# EasyEDA Pro project ProPrj_cbadge_2025-11-28.epro

# Schematic Schematic1
Board Name: Board1; Create Date: 2025-09-24; Page Name: P1; Project Name: cbadge; Schematic Name: Schematic1; Update Date: 2025-09-24; Company: EasyEDA.com; Page Size: A4; Version: V1.0
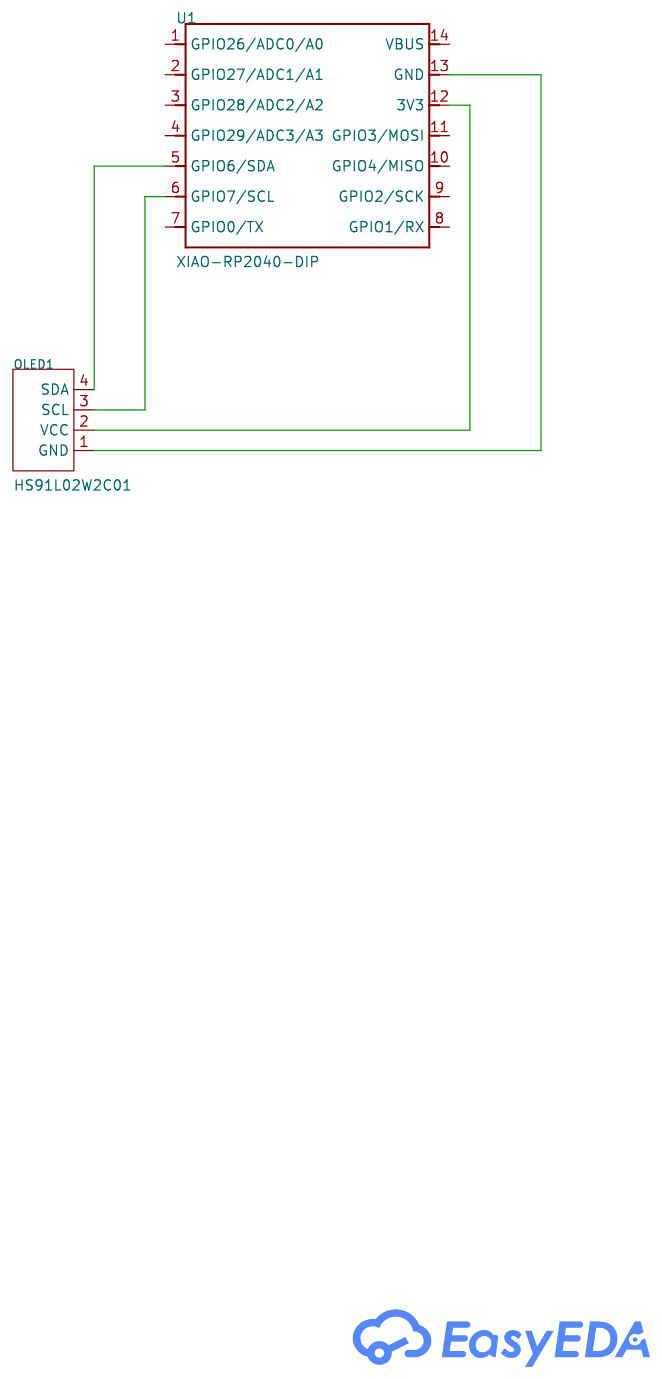
[diagram p0: schematic sheet]

## Parts
OLED1  HS91L02W2C01  [OLED-TH_L38.0-W12.0_HS91L02W2C01]
U1  XIAO-RP2040-DIP  [XIAO-RP2040-DIP]

## Library data of the parts
OLED1 = HS91L02W2C01: Main Control Chip:SSD1306 Interface Type:I2C Size:0.91 Pixel Resolution:128x32 Operating Temperature:-40℃~+70℃ Operating Temperature:-40℃~+70℃; LCSC Part Name: 0.91寸OLED显示屏白光IIC; Supplier Part: C5248081; Manufacturer: HS(汉昇); JLCPCB Part Class: Extended Part; Datasheet: https://atta.szlcsc.com/upload/public/pdf/source/20230727/C3E43C8E3DDA847F5681FEE7D95C153D.pdf; Supplier: LCSC; Main Control Chip: SSD1306; Interface Type: I2C; Size: 0.91; Pixel Resolution: 128x32; Operating Temperature: -40℃~+70℃
U1 = XIAO-RP2040-DIP

## Nets
$1N255: OLED1.4(SDA) U1.5(GPIO6/SDA)
$1N260: OLED1.3(SCL) U1.6(GPIO7/SCL)
$1N281: OLED1.1(GND) U1.13(GND)
$1N287: OLED1.2(VCC) U1.12(3V3)

Not connected (* = marked no-connect by the designer): U1 1(GPIO26/ADC0/A0) 2(GPIO27/ADC1/A1) 3(GPIO28/ADC2/A2) 4(GPIO29/ADC3/A3) 7(GPIO0/TX) 8(GPIO1/RX) 9(GPIO2/SCK) 10(GPIO4/MISO) 11(GPIO3/MOSI) 14(VBUS)

# Board PCB1
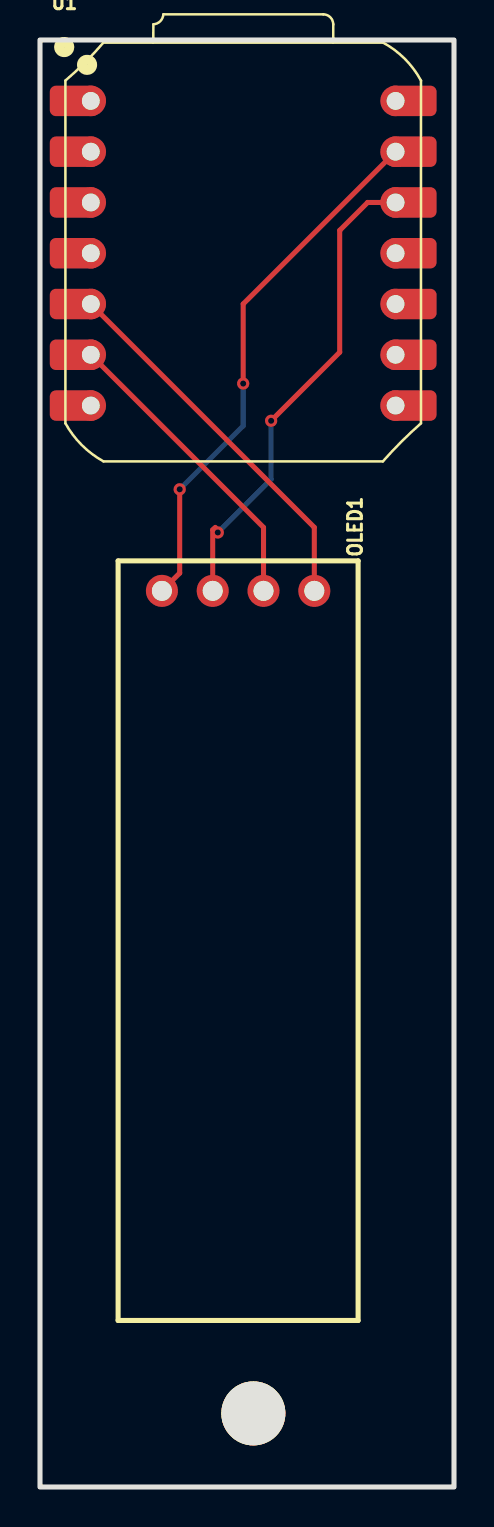
[diagram p1: board, top side]
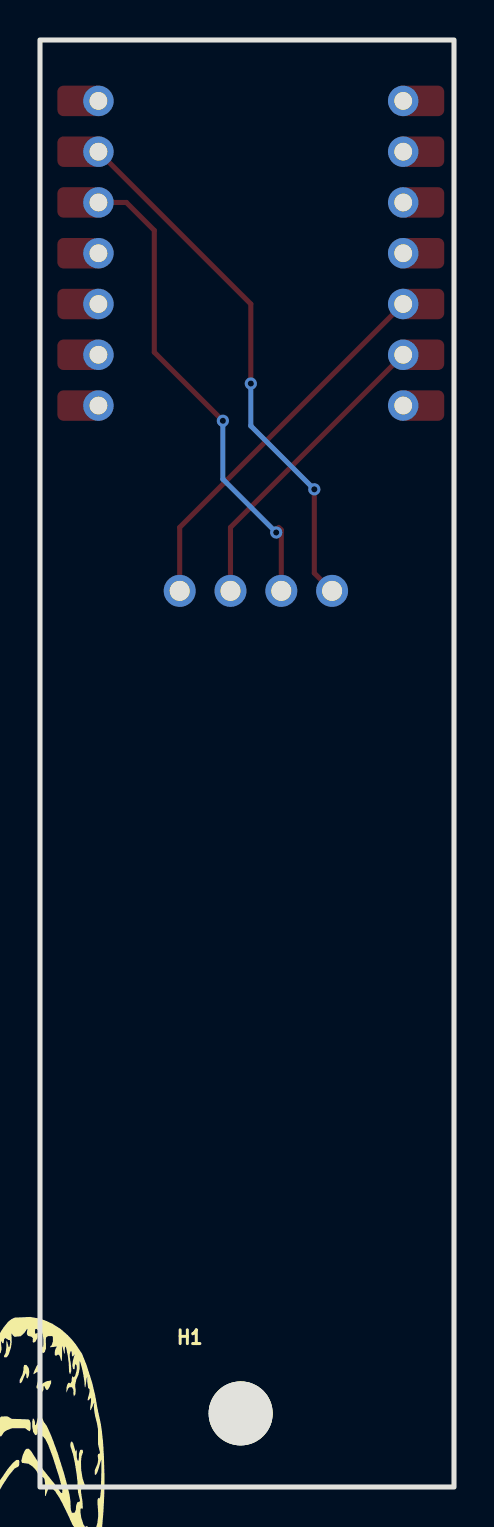
[diagram p2: board, bottom side, seen from below]

Outline 20.7 x 72.39 mm; copper layers: Top Layer, Bottom Layer. Coordinates in mm from the lower left corner of the outline.
Outline path: rectangle 0,72.39 20.7,0
Stack: Top Layer 0.035mm / Dielectric1 1.51mm FR4 er 4.5 / Bottom Layer 0.035mm

## Design rules (mm)
template: JLCPCB Capability(Two Layers Board)
spacing copperThickness1oz (default): track to track 0.102, other pairs 0.152 to 0.3
spacing copperThickness2oz: track to track 0.203, other pairs 0.152 to 0.3
track width copperThickness1oz (default): min 0.127, default 0.254, max 2.54
track width copperThickness2oz: min 0.203, default 0.254, max 2.54
differential pair differentialPair (default): width min 0.127, default 0.254, max 2.54; gap min 0.152, default 0.152
via viaSize (default): diameter min 0.5, default 0.61, max 10; hole min 0.3, default 0.305, max 6.3

## Placement (name value [footprint] x y rotation side)
H1  -  [0_User_Library:MountingHole_3.2mm_M3]  10.67 3.68 180 bottom
OLED1  HS91L02W2C01  [OLED-TH_L38.0-W12.0_HS91L02W2C01]  9.91 44.83 270 top
U1  -  [XIAO-RP2040-DIP]  10.16 61.72 0 top

## Footprints (pads in the part's own frame, mm; a bottom-side part is the same pattern mirrored in y, then rotated)
0_User_Library:MountingHole_3.2mm_M3
  round 3.2 hole 3.2: 1(0,0)
OLED-TH_L38.0-W12.0_HS91L02W2C01
  round 1.6 hole 1: 1(0,-3.81) 2(0,-1.27) 3(0,1.27) 4(0,3.81)
XIAO-RP2040-DIP
  rrect 2.432x1.524 smd: 1(-8.455,7.62) 2(-8.455,5.08) 3(-8.455,2.54) 4(-8.455,0) 5(-8.455,-2.54) 6(-8.455,-5.08) 7(-8.455,-7.62) 8(8.455,-7.62) 9(8.455,-5.08) 10(8.455,-2.54) 11(8.455,0) 12(8.455,2.54) 13(8.455,5.08) 14(8.455,7.62)
  round 1.524 hole 0.889: 1(-7.62,7.62) 2(-7.62,5.08) 3(-7.62,2.54) 4(-7.62,0) 5(-7.62,-2.54) 6(-7.62,-5.08) 7(-7.62,-7.62) 8(7.62,-7.62) 9(7.62,-5.08) 10(7.62,-2.54) 11(7.62,0) 12(7.62,2.54) 13(7.62,5.08) 14(7.62,7.62)

## Nets
As in the schematic.

Pads without a net: H1 1; U1 1 2 3 4 7 8 9 10 11 14

## Via types
v1: diameter 0.61, hole 0.305, Top Layer to Bottom Layer, 4 vias

## Routing (per net, layer and track width the routed paths; a pad name or vN(x,y) marks a point on that pad's centre or on a via; arc(x,y) is an arc through that point)
$1N255: length 19
  Top Layer w0.254: U1.5 13.72,48.01 OLED1.4
$1N260: length 15.4
  Top Layer w0.254: U1.6 11.18,48.01 11.18,44.83
$1N281: length 26.8
  Top Layer w0.254: OLED1.1 6.98,45.72 v1(6.98,49.91) ; v1(10.16,55.2) 10.16,59.18 U1.13
  Bottom Layer w0.254: v1(6.98,49.91) 10.16,53.09 v1(10.16,55.2)
$1N287: length 24.2
  Top Layer w0.254: v1(11.56,53.34) 14.99,56.77 14.99,62.86 16.38,64.26 U1.12 ; OLED1.2 8.64,47.88 8.76,48.01
  Bottom Layer w0.254: v1(11.56,53.34) 11.56,50.42 v1(8.89,47.75)
